# EAGLE design abs 555 (EAGLE 7.1.0)
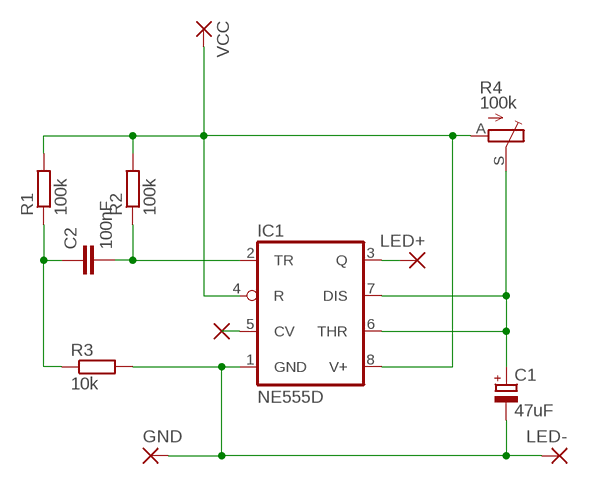
[diagram p0: schematic, sheet 1]

## Parts
C1  47uF  CPOL-EUD/7343-31W  [D/7343-31W]
C2  100nF  C-EUC0805  [C0805]
GND  2,54/0,8  [2,54/0,8]
IC1  NE555D  [SO08]
LED+  2,54/0,8  [2,54/0,8]
LED-  2,54/0,8  [2,54/0,8]
NC  0.1MMPAD  [PADS]
R1  100k  R-EU_R0805  [R0805]
R2  100k  R-EU_R0805  [R0805]
R3  10k  R-EU_R0805  [R0805]
R4  100k  TRIM_EU-CA6V  [CA6V]
VCC  2,54/0,8  [2,54/0,8]

## Nets
GND: C1.- GND.1(P) IC1.1(GND) LED-.1(P) R3.2
N$1: C2.2 IC1.2(TR) R2.1
N$2: C2.1 R1.1 R3.1
N$4: IC1.5(CV) NC.1(P)
N$5: C1.+ IC1.6(THR) IC1.7(DIS) R4.S
N$8: IC1.3(Q) LED+.1(P)
V+: IC1.4(R) IC1.8(V+) R1.2 R2.2 R4.A VCC.1(P)

## Library data of the parts
C1 = rcl:CPOL-EU: POLARIZED CAPACITOR, European symbol
C2 = resistor:C-EU: CAPACITOR, European symbol; SPICEPREFIX: C
GND LED+ LED- VCC = wirepad:2,54/0,8: THROUGH-HOLE PAD
IC1 = linear:*555: TIMER
NC = my:0.1MMPAD
R1-R3 = resistor:R-EU_: RESISTOR, European symbol; SPICEPREFIX: R
R4 = my_pot:TRIM_EU-: POTENTIOMETER

## Board
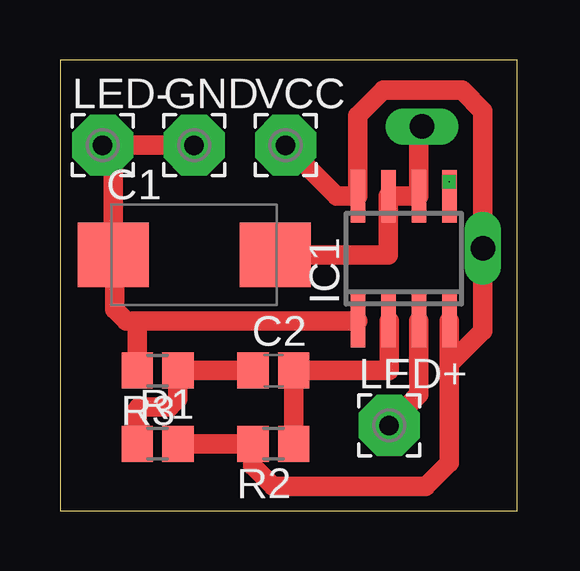
[diagram p1: board, top side]
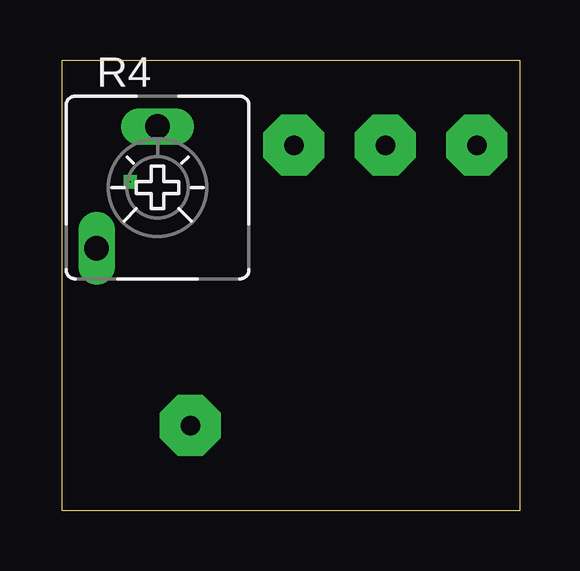
[diagram p2: board, bottom side, seen from below]

Size 19.05 x 18.8 mm. Coordinates in mm from the lower left corner, seen from the top.
Outline: 0,0 19.05,0 19.05,18.8 0,18.8 0,0
Copper layers (1*16): Top 0.035mm / dielectric 1.5mm / Bottom 0.035mm
Design rules "default": minimum track width 10mil, minimum drill 24mil, track to track 8mil, track to pad 8mil, pad to pad 8mil, via to via 8mil, smd to smd 8mil, copper to edge 40mil, drill to drill 8mil, minimum pad ring 10mil, minimum via ring 8mil, stop-mask expansion 4mil, vias tented up to drill 0mil, thermal gap 10mil

### Footprints (pad centres in the part's own frame; a part is rotated, then mirrored left to right if it is on the bottom)
D/7343-31W = smd 2.95 x 2.7: + 3.375,0; - -3.375,0
C0805 = smd 1.3 x 1.5: 1 -0.85,0; 2 0.85,0
2,54/0,8 = drill 0.813 pad 2.54 octagon: 1 0,0
SO08 = smd 0.6 x 2.2: 1 -1.905,-2.6; 2 -0.635,-2.6; 3 0.635,-2.6; 4 1.905,-2.6; 5 1.905,2.6; 6 0.635,2.6; 7 -0.635,2.6; 8 -1.905,2.6
PADS = drill 0.05 pad 0.1 square: 1 0,0
R0805 = smd 1.3 x 1.5: 1 -0.85,0; 2 0.85,0
CA6V = drill 1.016 long: A -2.54,-2.54; S 0,2.54

### Placement (x,y rotation side)
C1  5.59,10.67 0 top
C2  8.89,5.84 0 top
GND  5.59,15.24 0 top
IC1  14.32,10.51 0 top
LED+  13.72,3.56 0 top
LED-  1.78,15.24 0 top
NC  16.22,13.72 0 top
R1  4.06,2.79 0 top
R2  8.89,2.79 180 top
R3  4.06,5.84 180 top
R4  15.08,13.48 0 bottom
VCC  9.4,15.24 0 top

### Tracks (layer width: path | path; a pad name or v marks a point on that pad's centre or on a via)
GND
  Top 0.406: 2.76,7.91 3.05,7.91 3.21,7.74 | 2.29,10.6 C1.- | 2.21,14.8 LED-.1
  Top 0.813: IC1.1 3.05,7.91 | 2.76,7.91 2.29,8.38 2.29,10.6 | C1.- 2.21,14.8 | LED-.1 GND.1 | R3.2 3.21,7.74
N$1
  Top 0.406: IC1.2 13.72,7.91
  Top 0.813: 13.72,7.91 13.72,5.84 C2.2 R2.1
N$2
  Top 0.813: C2.1 R3.1 4.91,4.66 4.57,4.32 3.3,4.32 3.21,4.23 R1.1
N$4
  Top 0.406: IC1.5 NC.1
N$5
  Top 0.813: C1.+ 13.68,10.67 IC1.7 IC1.6 14.95,15.89 R4.S
N$8
  Top 0.813: IC1.3 14.95,4.86 LED+.1
V+
  Top 0.813: VCC.1 11.53,13.11 IC1.8 12.41,16.48 13.46,17.53 16.76,17.53 17.62,16.67 R4.A 17.62,7.49 16.22,6.1 | R1.2 R2.2 8.04,1.87 8.89,1.02 15.24,1.02 16.22,2 16.22,6.1 | IC1.4 16.22,6.1